# Altium schematic sheet 07.SchDoc
size 297 x 209 mm
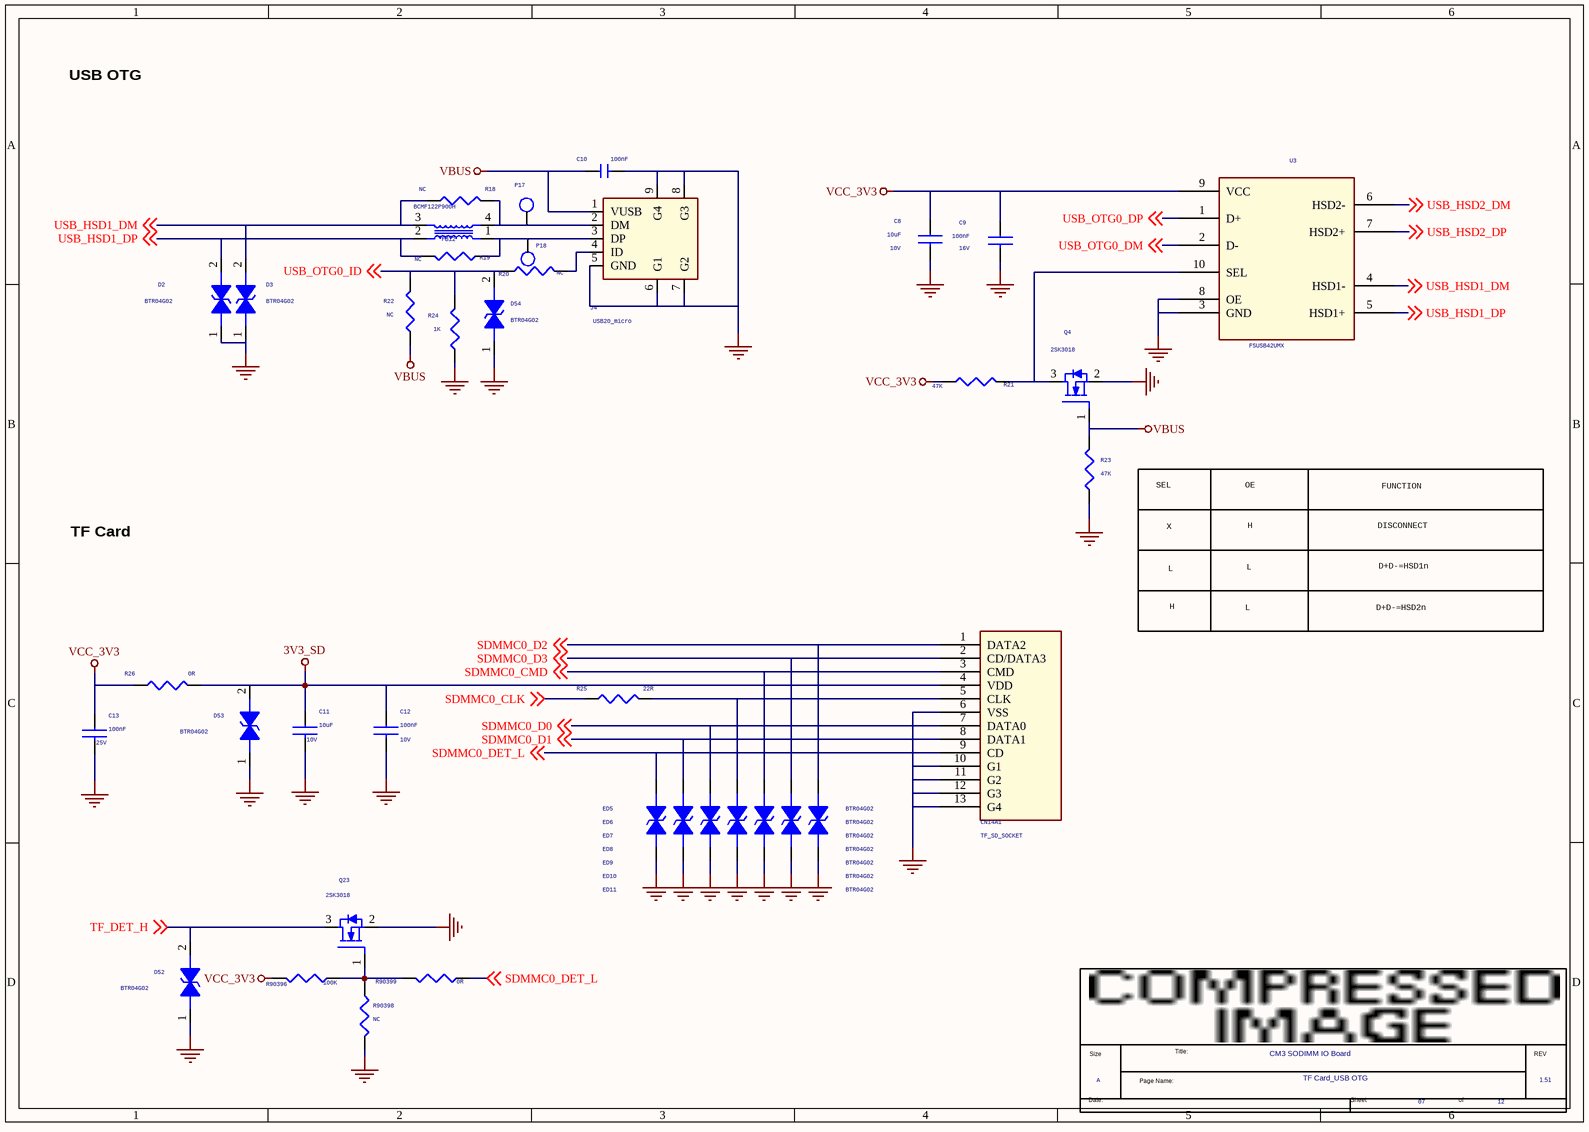
[diagram p0: 07.SchDoc]

## Parts
*  Page Count: 12  Page Number: 07  Page Size: A  Title: CM3 SODIMM IO Board  RevCode: 1.51  Doc: TF Card_USB OTG  (hidden comment: radxa_1010)  (graphical)
C8  10uF  Voltage: 10V  [C0603]
C9  100nF  Voltage: 16V  [C0402]
C10  100nF  [C0603]
C11  10uF  Voltage: 10V  [C0603]
C12  100nF  Voltage: 10V  [C0402]
C13  100nF  Voltage: 25V  [C0402]
CN14A1  TF_SD_SOCKET  [TF-CKT01-009D]
D2  BTR04G02  [ESD0402_1xD5]
D3  BTR04G02  [ESD0402_1xD5]
D52  BTR04G02  [ESD0402_1xD5]
D53  BTR04G02  [ESD0402_1xD5]
D54  BTR04G02  [ESD0402_1xD5]
ED5  BTR04G02  [ESD0402_1xD5]
ED6  BTR04G02  [ESD0402_1xD5]
ED7  BTR04G02  [ESD0402_1xD5]
ED8  BTR04G02  [ESD0402_1xD5]
ED9  BTR04G02  [ESD0402_1xD5]
ED10  BTR04G02  [ESD0402_1xD5]
ED11  BTR04G02  [ESD0402_1xD5]
FB12  BCMF122P900H  [GMDG-4PIN_ESD]
J4  USB20_micro  [USB-5PAA]
P17  TEST  [TEST]  (value not drawn)
P18  TEST  [TEST]  (value not drawn)
Q4  2SK3018  [SOT23]
Q23  2SK3018  [SOT23]
R18  NC  [R0402]
R19  NC  [R0402]
R20  NC  [R0402]
R21  47K  [R0402]
R22  NC  [R0402]
R23  47K  [R0402]
R24  1K  [R0603]
R25  22R  [R0402]
R26  0R  [R0402]
R90396  100K  [R0201]
R90398  NC  [R0402]
R90399  0R  [R0201]
U3  FSUSB42UMX  [UMLP-10]

## Nets
3V3_SD: C11.1 C12.1 CN14A1.4(VDD) D53.2 R26.2
GND: C8.2 C9.2 C10.2 C11.2 C12.2 C13.2 CN14A1.6(VSS) CN14A1.10(G1) CN14A1.11(G2) CN14A1.12(G3) CN14A1.13(G4) D2.1 D3.1 D52.1 D53.1 D54.1 ED5.2 ED6.2 ED7.2 ED8.2 ED9.2 ED10.2 ED11.2 J4.5(GND) J4.6(G1) J4.7(G2) J4.8(G3) J4.9(G4) Q4.2(SOURCE) Q23.2(SOURCE) R23.2 R24.2 R90398.2 U3.3(GND) U3.8(OE)
VBUS: C10.1 J4.1(VUSB) Q4.1(GATE) R22.2 R23.1
VCC_3V3: C8.1 C9.1 C13.1 R21.2 R26.1 R90396.2 U3.9(VCC)
SDMMC0_CLK: R25.1 ; off-sheet SDMMC0_CLK
SDMMC0_CMD: CN14A1.3(CMD) ED9.1 ; off-sheet SDMMC0_CMD
SDMMC0_D0: CN14A1.7(DATA0) ED7.1 ; off-sheet SDMMC0_D0
SDMMC0_D1: CN14A1.8(DATA1) ED6.1 ; off-sheet SDMMC0_D1
SDMMC0_D2: CN14A1.1(DATA2) ED11.1 ; off-sheet SDMMC0_D2
SDMMC0_D3: CN14A1.2(CD/DATA3) ED10.1 ; off-sheet SDMMC0_D3
SDMMC0_DET_L: CN14A1.9(CD) ED5.1 R90399.1 ; off-sheet SDMMC0_DET_L
TF_DET_H: D52.2 Q23.3(DRAIN) ; off-sheet TF_DET_H
USB_HSD1_DM: D3.2 FB12.3(R3) R18.2 U3.4(HSD1-) ; off-sheet USB_HSD1_DM
USB_HSD1_DP: D2.2 FB12.2(R4) R19.2 U3.5(HSD1+) ; off-sheet USB_HSD1_DP
USB_HSD2_DM: U3.6(HSD2-) ; off-sheet USB_HSD2_DM
USB_HSD2_DP: U3.7(HSD2+) ; off-sheet USB_HSD2_DP
USB_OTG0_DM: U3.2(D-) ; off-sheet USB_OTG0_DM
USB_OTG0_DP: U3.1(D+) ; off-sheet USB_OTG0_DP
USB_OTG0_ID: D54.2 R20.2 R22.1 R24.1 ; off-sheet USB_OTG0_ID
NetCN14A1_5: CN14A1.5(CLK) ED8.1 R25.2
NetFB12_1: FB12.1(R1) J4.3(DP) P18.1 R19.1
NetFB12_4: FB12.4(R2) J4.2(DM) P17.1 R18.1
NetJ4_4: J4.4(ID) R20.1
NetQ4_3: Q4.3(DRAIN) R21.1 U3.10(SEL)
NetQ23_1: Q23.1(GATE) R90396.1 R90398.1 R90399.2

## Notes on the sheet
- USB OTG
- TF Card
- SEL
- X
- OE
- H
- DISCONNECT
- FUNCTION
- L
- D+D-=HSD2n
- D+D-=HSD1n
- (in symbol radxa_1010) Title:; Size; REV; Page Name:; Date:; Sheet; of

## Library data of the parts
C8 C11 = CAP NP_0: cap,10.00uF,+/-10%,10V,X5R,C0603; Manufacturer: TDK; RK PN: C1608X5R1A106K080AC; Priority: A; C_Voltage: 6.3V; Tolerance: 10%; Dielectric: X5R; Part Type: C0603; Manufacturer PN: C1608X5R1A106K080AC; Created by: JJJ
C9 C13 = CAP NP_0: cap,100.00nF,+/-10%,16V,X5R,C0402; Manufacturer: TDK; RK PN: C1005X5R1C104K050BA; Priority: A; Tolerance: 10%; Dielectric: X5R; Part Type: C0402; Manufacturer PN: C1005X5R1C104K050BA; Created by: JJJ
C10 = CAP_0.1uF_0603
C12 = CAP NP_0: cap,100.00nF,+/-10%,10V,X5R,C0402; Manufacturer: TDK; RK PN: C1005X5R1A104K050BA; Priority: A; Tolerance: 10%; C_Voltage: 6.3V; Dielectric: X5R; Part Type: C0402; Manufacturer PN: C1005X5R1A104K050BA; Created by: JJJ
CN14A1 = SD_SOCKET_0
D2 D52 D54 = DIODE BI_DIR TRIG: 1-Line, Bi-directional, Transient Voltage Suppressors.17.5pF.; Manufacturer PN: ESD5451N; Manufacturer: WillSemi(韦尔半导体); OPTION: DNP; Priority: A; Created by: JJJ; Part Type: ESD_TVS; RK PN: ESD5451N
D3 D53 = DIODE BI_DIR TRIG: 1-Line, Bi-directional, Transient Voltage Suppressors.17.5pF.; Manufacturer: WillSemi(韦尔半导体); RK PN: ESD5451N; Priority: A; OPTION: DNP; Part Type: ESD_TVS; Manufacturer PN: ESD5451N; Created by: JJJ
ED5-ED11 = DIODE BI-DIR TRIG: ESD
FB12 = R-PACK4_3
J4 = USB20_MICRO: micro型USB2.0座，卧式，贴焊; Manufacturer: 祺华电子; Priority: A; RK PN: USB20_micro; Part Type: USB Jack; Manufacturer Part Number: USB20_micro; Created by: JJJ
P17 P18 = TESTPOINT1
Q4 = MOSFET N: NMOS,2SK3018,SOT_323,Id=0.1A,Vds=30V; Manufacturer: ROHM; Pd: 0.2W; Vgsth: 1.5V; VDS: 30V; Vgs: 20V; Id_max: 0.1A; Priority: A; Rds: 5ohm; Created by: JJJ; Manufacturer PN: 2SK3018; Part Type: NMOS; RK PN: 2SK3018
Q23 = MOSFET N: NMOS,2SK3018,SOT_323,Id=0.1A,Vds=30V; Manufacturer: ROHM; Rds: 5ohm; Priority: A; Id_max: 0.1A; Vgs: 20V; VDS: 30V; Vgsth: 1.5V; Pd: 0.2W; RK PN: 2SK3018; Part Type: NMOS; Manufacturer PN: 2SK3018; Created by: JJJ
R18 R19 R21 R22 = RESISTOR_0: 通用厚膜电阻,0R,+/-5%,R0402,1/16W.; Manufacturer: YAGEO; Tolerance: 5%; RK PN: RC0402JR-070RL; Priority: A; Wattage: 1/16W; Part Type: 通用厚膜电阻; Manufacturer PN: RC0402JR-070RL; Created by: YTL
R20 R26 = RESISTOR_0: 通用厚膜电阻,0R,+/-5%,R0402,1/16W.; Manufacturer PN: RC0402JR-070RL; Manufacturer: YAGEO; Tolerance: 5%; Wattage: 1/16W; Priority: A; Created by: YTL; Part Type: 通用厚膜电阻; RK PN: RC0402JR-070RL
R23 = RESISTOR_0: 通用厚膜电阻,10K,+/-5%,R0402,1/16W.; Manufacturer PN: RC0402JR-0710KL; Manufacturer: YAGEO; Tolerance: 5%; Wattage: 1/16W; Priority: A; Created by: YTL; Part Type: 通用厚膜电阻; RK PN: RC0402JR-0710KL
R24 = RES_0603
R25 = RESISTOR_1
R90396 R90399 = RESISTOR_1: RES,thick film,47KOhm,+/-5%,1/16W,SMD0402
R90398 = RESISTOR_0_Dup1: 通用厚膜电阻,10K,+/-1%,R0402,1/16W.; Manufacturer: YAGEO; Tolerance: 5%; RK PN: RC0402FR-0710KL; Priority: A; Wattage: 1/16W; Part Type: 通用厚膜电阻; Manufacturer PN: RC0402FR-0710KL; Created by: YTL
U3 = HT188_0
* = radxa_1010: Page Create Date: March  8, 1995